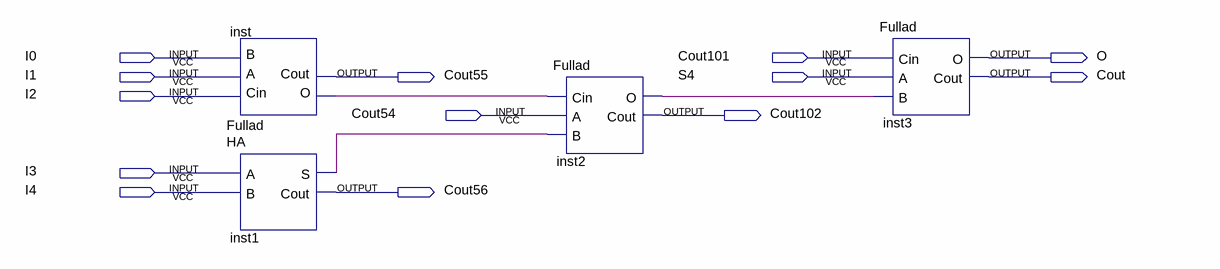
[diagram p0: schematic sheet]
// Quartus schematic B8.bdf as structural Verilog: 4 symbols, 13 pins
module B8 (
  input  I0,
  input  Cout101,
  input  I1,
  input  S4,
  input  I2,
  input  Cout54,
  input  I3,
  input  I4,
  output O,
  output Cout55,
  output Cout,
  output Cout102,
  output Cout56
);

  wire inst1_s, inst2_o, inst_o;

  Fullad inst (.Cin(I2), .A(I1), .B(I0), .O(inst_o), .Cout(Cout55));
  HA inst1 (.A(I3), .B(I4), .S(inst1_s), .Cout(Cout56));
  Fullad inst2 (.Cin(inst_o), .A(Cout54), .B(inst1_s), .O(inst2_o), .Cout(Cout102));
  Fullad inst3 (.Cin(Cout101), .A(S4), .B(inst2_o), .O(O), .Cout(Cout));
endmodule
